# EAGLE design RK05TA (EAGLE 6.6.0)

## Sheet 1 of 2
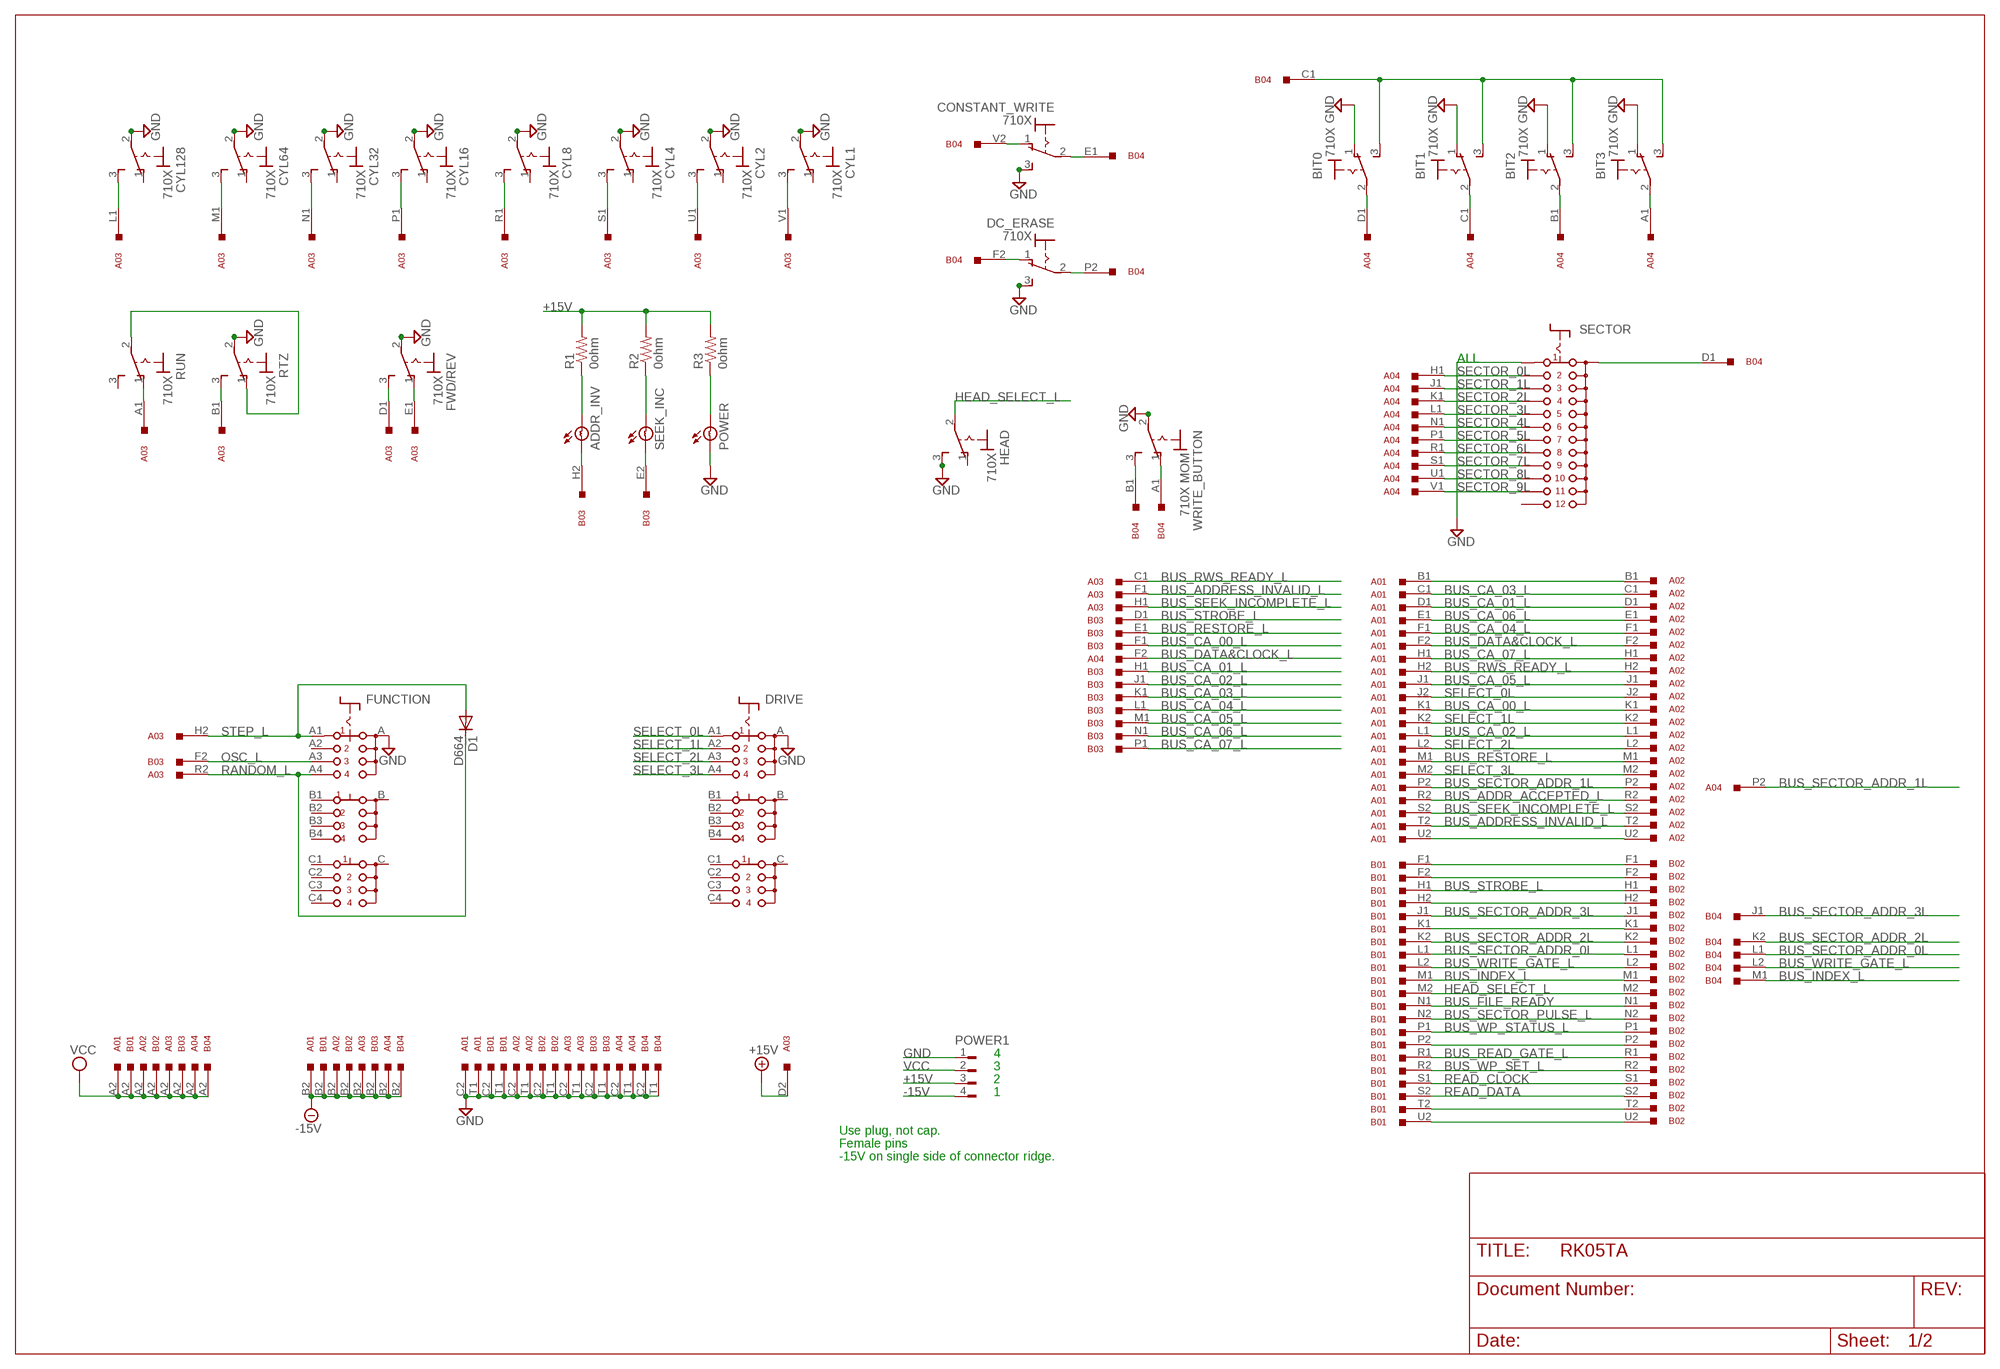
[diagram p0: schematic, sheet 1]

### Parts
A01  BC11A  M916  [H807]
A02  M930  M916  [H807]
A03  G503  M916  [H807]
A04  G502  M916  [H807]
ADDR_INV  BULB  [BULB]
B01  BC11A  M916  [H807]
B02  M930  M916  [H807]
B03  G503  M916  [H807]
B04  G502  M916  [H807]
BIT0  710X  [7109MD9V3]
BIT1  710X  [7109MD9V3]
BIT2  710X  [7109MD9V3]
BIT3  710X  [7109MD9V3]
CONSTANT_WRITE  710X  [7109MD9V3]
CYL1  710X  [7109MD9V3]
CYL2  710X  [7109MD9V3]
CYL4  710X  [7109MD9V3]
CYL8  710X  [7109MD9V3]
CYL16  710X  [7109MD9V3]
CYL32  710X  [7109MD9V3]
CYL64  710X  [7109MD9V3]
CYL128  710X  [7109MD9V3]
D1  D664  1N4148DO35-10  [DO35-10]
DC_ERASE  710X  [7109MD9V3]
DRIVE  CK103X04  [CK103X04]
FUNCTION  CK103X04  [CK103X04]
FWD/REV  710X  [7109MD9V3]
HEAD  710X  [7109MD9V3]
POWER  BULB  [BULB]
POWER1  FLOPPY-4  [FLOPPY-4]
R1  0ohm  R-US_0207/10  [0207/10]
R2  0ohm  R-US_0207/10  [0207/10]
R3  0ohm  R-US_0207/10  [0207/10]
RTZ  710X  [7109MD9V3]
RUN  710X  [7109MD9V3]
SECTOR  CK101X12  [CK101X12]
SEEK_INC  BULB  [BULB]
WRITE_BUTTON  710X MOM  710X  [7109MD9V3]

### Nets
+3VA: B04.F2 DC_ERASE.1(O) ; also sheet 2
+3VC: B04.V2 CONSTANT_WRITE.1(O) ; also sheet 2
+15V [Supply]: A03.D2 POWER1.3 R1.2 R2.2 R3.2 ; also sheet 2
-15V [Supply]: A01.B2 A02.B2 A03.B2 A04.B2 B01.B2 B02.B2 B03.B2 B04.B2 POWER1.4 ; also sheet 2
ADDRESS_INVALID_L: ADDR_INV.B B03.H2 ; also sheet 2
BIT_0L: A04.D1 BIT0.2(P) ; also sheet 2
BIT_1L: A04.C1 BIT1.2(P) ; also sheet 2
BIT_2L: A04.B1 BIT2.2(P) ; also sheet 2
BIT_3L: A04.A1 BIT3.2(P) ; also sheet 2
BUS_ADDR_ACCEPTED_L: A01.R2 A02.R2
BUS_ADDRESS_INVALID_L: A01.T2 A02.T2 A03.F1
BUS_CA_00_L: A01.K1 A02.K1 B03.F1
BUS_CA_01_L: A01.D1 A02.D1 B03.H1
BUS_CA_02_L: A01.L1 A02.L1 B03.J1
BUS_CA_03_L: A01.C1 A02.C1 B03.K1
BUS_CA_04_L: A01.F1 A02.F1 B03.L1
BUS_CA_05_L: A01.J1 A02.J1 B03.M1
BUS_CA_06_L: A01.E1 A02.E1 B03.N1
BUS_CA_07_L: A01.H1 A02.H1 B03.P1
BUS_DATA&CLOCK_L: A01.F2 A02.F2 A04.F2
BUS_FILE_READY: B01.N1 B02.N1
BUS_INDEX_L: B01.M1 B02.M1 B04.M1
BUS_READ_GATE_L: B01.R1 B02.R1
BUS_RESTORE_L: A01.M1 A02.M1 B03.E1
BUS_RWS_READY_L: A01.H2 A02.H2 A03.C1
BUS_SECTOR_ADDR_0L: B01.L1 B02.L1 B04.L1
BUS_SECTOR_ADDR_1L: A01.P2 A02.P2 A04.P2
BUS_SECTOR_ADDR_2L: B01.K2 B02.K2 B04.K2
BUS_SECTOR_ADDR_3L: B01.J1 B02.J1 B04.J1
BUS_SECTOR_PULSE_L: B01.N2 B02.N2
BUS_SEEK_INCOMPLETE_L: A01.S2 A02.S2 A03.H1
BUS_STROBE_L: B01.H1 B02.H1 B03.D1
BUS_WP_SET_L: B01.R2 B02.R2
BUS_WP_STATUS_L: B01.P1 B02.P1
BUS_WRITE_GATE_L: B01.L2 B02.L2 B04.L2
CA_SW_1: A03.V1 CYL1.3(S) ; also sheet 2
CA_SW_2: A03.U1 CYL2.3(S) ; also sheet 2
CA_SW_4: A03.S1 CYL4.3(S) ; also sheet 2
CA_SW_8: A03.R1 CYL8.3(S) ; also sheet 2
CA_SW_16: A03.P1 CYL16.3(S) ; also sheet 2
CA_SW_32: A03.N1 CYL32.3(S) ; also sheet 2
CA_SW_64: A03.M1 CYL64.3(S) ; also sheet 2
CA_SW_128: A03.L1 CYL128.3(S) ; also sheet 2
CONSTANT_WRITE_L: B04.E1 CONSTANT_WRITE.2(P) ; also sheet 2
DATA_BITS: B04.C1 BIT0.3(S) BIT1.3(S) BIT2.3(S) BIT3.3(S) ; also sheet 2
DC_ERASE: B04.P2 DC_ERASE.2(P) ; also sheet 2
FWD_L: A03.D1 FWD/REV.3(S) ; also sheet 2
GND [Supply]: A01.C2 A01.T1 A02.C2 A02.T1 A03.C2 A03.T1 A04.C2 A04.T1 B01.C2 B01.T1 B02.C2 B02.T1 B03.C2 B03.T1 B04.C2 B04.T1 BIT0.1(O) BIT1.1(O) BIT2.1(O) BIT3.1(O) CONSTANT_WRITE.3(S) CYL1.2(P) CYL2.2(P) CYL4.2(P) CYL8.2(P) CYL16.2(P) CYL32.2(P) CYL64.2(P) CYL128.2(P) DC_ERASE.3(S) DRIVE.A FUNCTION.A FWD/REV.2(P) HEAD.3(S) POWER1.1 POWER.B RTZ.2(P) SECTOR.1 WRITE_BUTTON.2(P) ; also sheet 2
HEAD_SELECT_L: B01.M2 B02.M2 HEAD.2(P) ; also sheet 2
N$30: RTZ.1(O) RUN.2(P)
N$37: ADDR_INV.A R1.1
N$38: R2.1 SEEK_INC.A
N$39: POWER.A R3.1
N$45: A01.U2 A02.U2
N$49: B01.T2 B02.T2
N$50: A01.B1 A02.B1
N$51: B01.F1 B02.F1
N$52: B01.F2 B02.F2
N$54: B01.H2 B02.H2
N$56: B01.K1 B02.K1
N$74: B01.P2 B02.P2
N$79: B01.U2 B02.U2
OSC_L: B03.F2 FUNCTION.A3 ; also sheet 2
RANDOM_L: A03.R2 D1.C FUNCTION.A4 ; also sheet 2
READ_CLOCK: B01.S1 B02.S1
READ_DATA: B01.S2 B02.S2
REV_L: A03.E1 FWD/REV.1(O) ; also sheet 2
RTZ_L: A03.B1 RTZ.3(S) ; also sheet 2
RUN_L: A03.A1 RUN.1(O) ; also sheet 2
SECTOR_0L: A04.H1 SECTOR.2 ; also sheet 2
SECTOR_1L: A04.J1 SECTOR.3 ; also sheet 2
SECTOR_2L: A04.K1 SECTOR.4 ; also sheet 2
SECTOR_3L: A04.L1 SECTOR.5 ; also sheet 2
SECTOR_4L: A04.N1 SECTOR.6 ; also sheet 2
SECTOR_5L: A04.P1 SECTOR.7 ; also sheet 2
SECTOR_6L: A04.R1 SECTOR.8 ; also sheet 2
SECTOR_7L: A04.S1 SECTOR.9 ; also sheet 2
SECTOR_8L: A04.U1 SECTOR.10 ; also sheet 2
SECTOR_9L: A04.V1 SECTOR.11 ; also sheet 2
SECTOR_SELECT_L: B04.D1 SECTOR.A ; also sheet 2
SEEK_INCOMPLETE_L: B03.E2 SEEK_INC.B ; also sheet 2
SELECT_0L: A01.J2 A02.J2 DRIVE.A1 ; also sheet 2
SELECT_1L: A01.K2 A02.K2 DRIVE.A2 ; also sheet 2
SELECT_2L: A01.L2 A02.L2 DRIVE.A3 ; also sheet 2
SELECT_3L: A01.M2 A02.M2 DRIVE.A4 ; also sheet 2
STEP_L: A03.H2 D1.A FUNCTION.A1 ; also sheet 2
VCC [Supply]: A01.A2 A02.A2 A03.A2 A04.A2 B01.A2 B02.A2 B03.A2 B04.A2 POWER1.2 ; also sheet 2
WRITE_H: B04.A1 WRITE_BUTTON.1(O) ; also sheet 2
WRITE_L: B04.B1 WRITE_BUTTON.3(S) ; also sheet 2
Unconnected: A01.A1 A01.D2 A01.E2 A01.N1 A01.N2 A01.P1 A01.R1 A01.S1 A01.U1 A01.V1 A01.V2 A02.A1 A02.D2 A02.E2 A02.N1 A02.N2 A02.P1 A02.R1 A02.S1 A02.U1 A02.V1 A02.V2 A03.E2 A03.F2 A03.J1 A03.J2 A03.K1 A03.K2 A03.L2 A03.M2 A03.N2 A03.P2 A03.S2 A03.T2 A03.U2 A03.V2 A04.D2 A04.E1 A04.E2 A04.F1 A04.H2 A04.J2 A04.K2 A04.L2 A04.M1 A04.M2 A04.N2 A04.R2 A04.S2 A04.T2 A04.U2 A04.V2 B01.A1 B01.B1 B01.C1 B01.D1 B01.D2 B01.E1 B01.E2 B01.J2 B01.U1 B01.V1 B01.V2 B02.A1 B02.B1 B02.C1 B02.D1 B02.D2 B02.E1 B02.E2 B02.J2 B02.U1 B02.V1 B02.V2 B03.A1 B03.B1 B03.C1 B03.D2 B03.J2 B03.K2 B03.L2 B03.M2 B03.N2 B03.P2 B03.R1 B03.R2 B03.S1 B03.S2 B03.T2 B03.U1 B03.U2 B03.V1 B03.V2 B04.D2 B04.E2 B04.F1 B04.H1 B04.H2 B04.J2 B04.K1 B04.M2 B04.N1 B04.N2 B04.P1 B04.R1 B04.R2 B04.S1 B04.S2 B04.T2 B04.U1 B04.U2 B04.V1 CYL1.1(O) CYL2.1(O) CYL4.1(O) CYL8.1(O) CYL16.1(O) CYL32.1(O) CYL64.1(O) CYL128.1(O) DRIVE.B DRIVE.B1 DRIVE.B2 DRIVE.B3 DRIVE.B4 DRIVE.C DRIVE.C1 DRIVE.C2 DRIVE.C3 DRIVE.C4 FUNCTION.A2 FUNCTION.B FUNCTION.B1 FUNCTION.B2 FUNCTION.B3 FUNCTION.B4 FUNCTION.C FUNCTION.C1 FUNCTION.C2 FUNCTION.C3 FUNCTION.C4 HEAD.1(O) RUN.3(S) SECTOR.12

### Notes on the sheet
- ALL
- 4
- 3
- 2
- 1
- Use plug, not cap.
- Female pins
- -15V on single side of connector ridge.

## Sheet 2 of 2
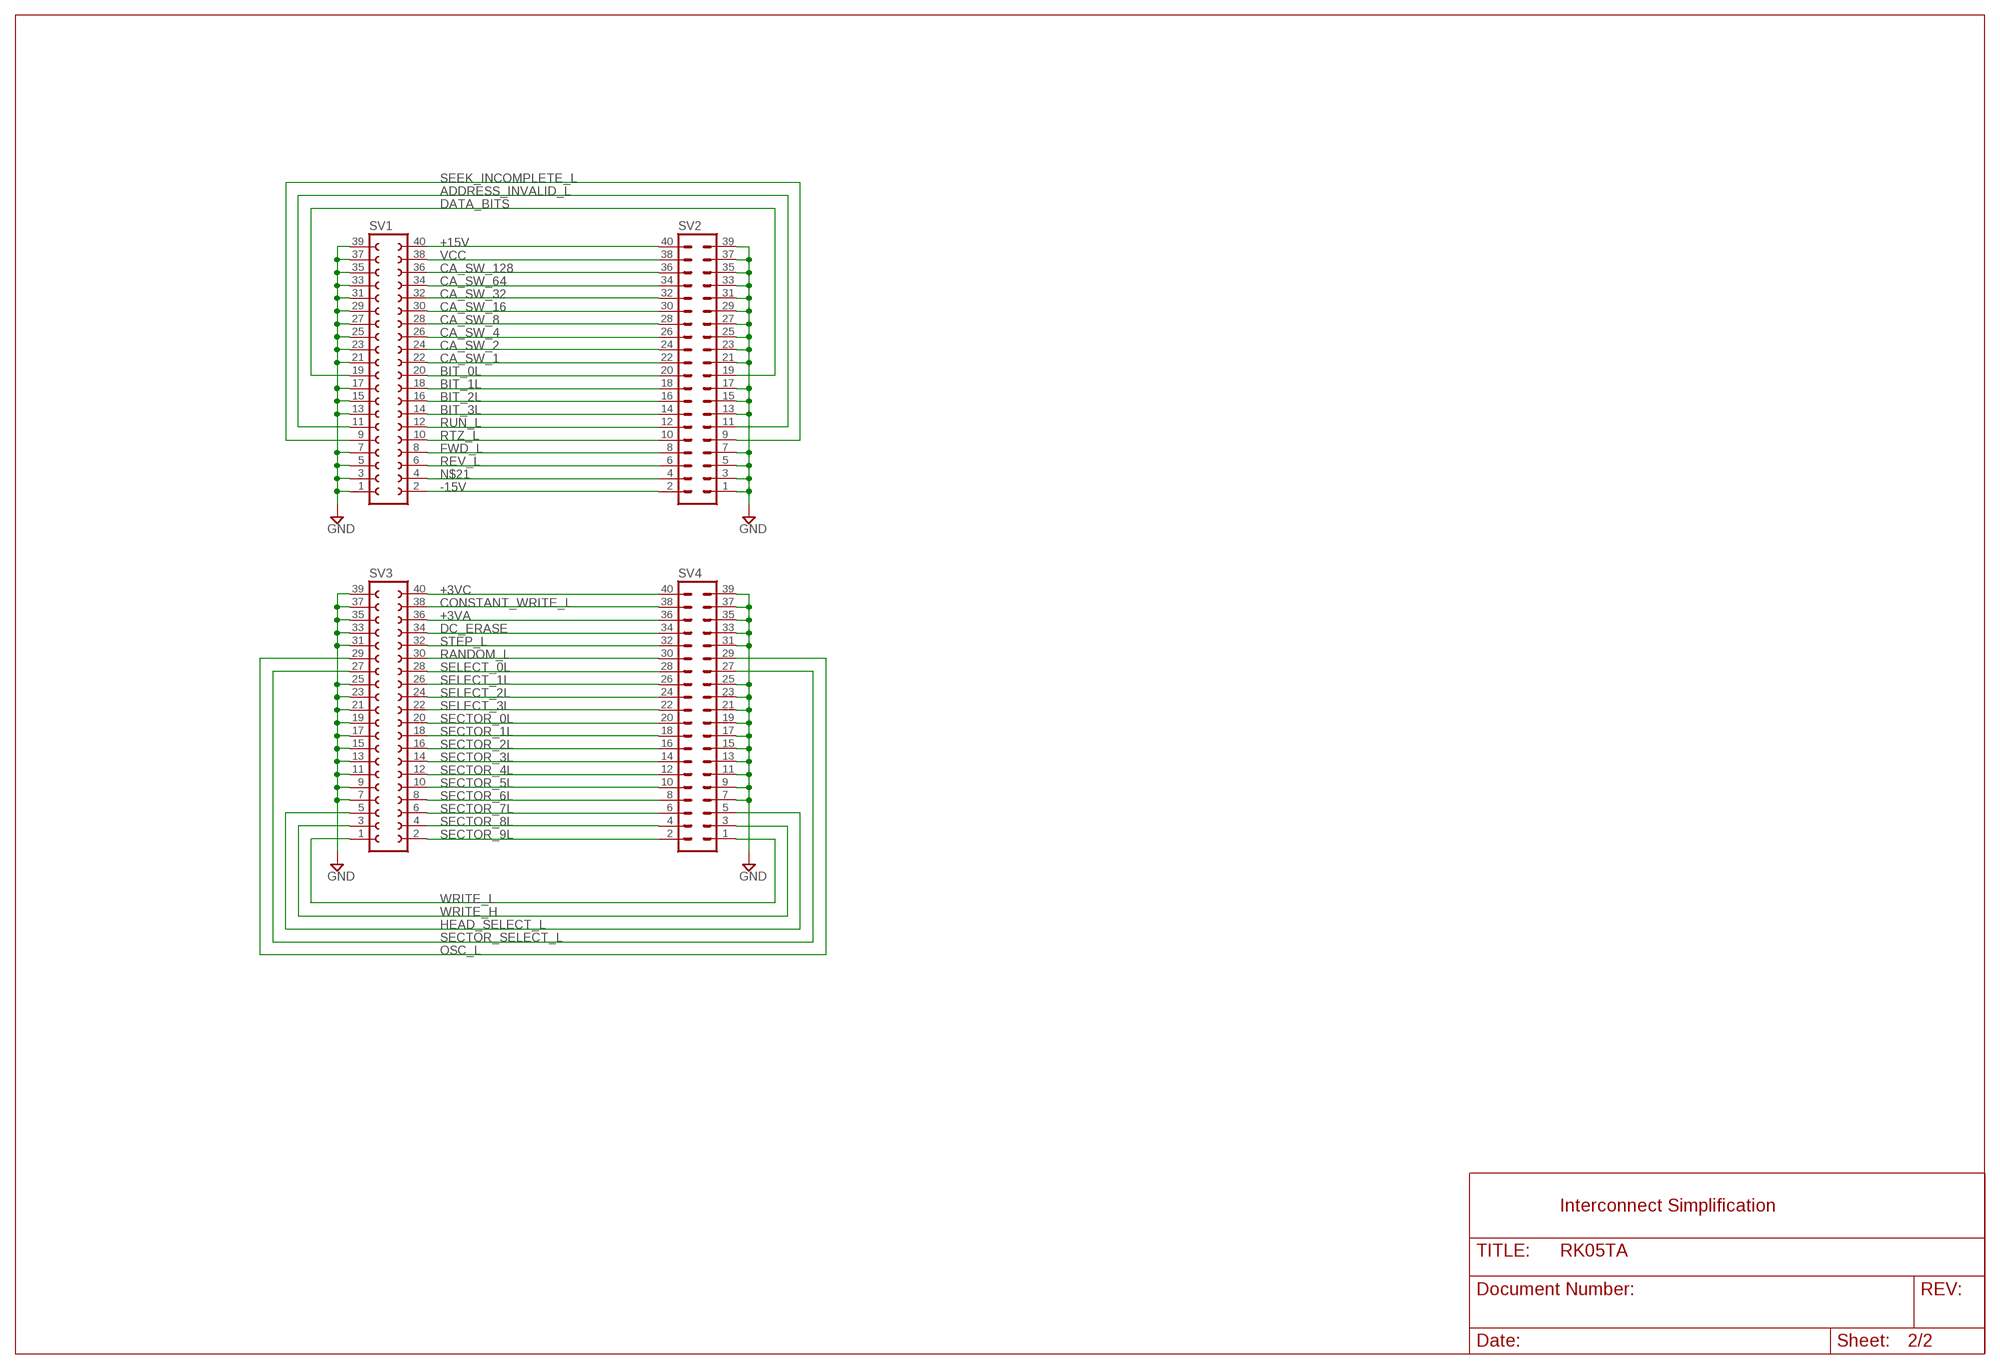
[diagram p1: schematic, sheet 2]

### Parts
SV1  FE20-2W  [FE20-2W]
SV2  MA20-2  [MA20-2]
SV3  FE20-2W  [FE20-2W]
SV4  MA20-2  [MA20-2]

### Nets
+3VA: SV3.36 SV4.36 ; also sheet 1
+3VC: SV3.40 SV4.40 ; also sheet 1
+15V [Supply]: SV1.40 SV2.40 ; also sheet 1
-15V [Supply]: SV1.2 SV2.2 ; also sheet 1
ADDRESS_INVALID_L: SV1.11 SV2.11 ; also sheet 1
BIT_0L: SV1.20 SV2.20 ; also sheet 1
BIT_1L: SV1.18 SV2.18 ; also sheet 1
BIT_2L: SV1.16 SV2.16 ; also sheet 1
BIT_3L: SV1.14 SV2.14 ; also sheet 1
CA_SW_1: SV1.22 SV2.22 ; also sheet 1
CA_SW_2: SV1.24 SV2.24 ; also sheet 1
CA_SW_4: SV1.26 SV2.26 ; also sheet 1
CA_SW_8: SV1.28 SV2.28 ; also sheet 1
CA_SW_16: SV1.30 SV2.30 ; also sheet 1
CA_SW_32: SV1.32 SV2.32 ; also sheet 1
CA_SW_64: SV1.34 SV2.34 ; also sheet 1
CA_SW_128: SV1.36 SV2.36 ; also sheet 1
CONSTANT_WRITE_L: SV3.38 SV4.38 ; also sheet 1
DATA_BITS: SV1.19 SV2.19 ; also sheet 1
DC_ERASE: SV3.34 SV4.34 ; also sheet 1
FWD_L: SV1.8 SV2.8 ; also sheet 1
GND [Supply]: SV1.1 SV1.3 SV1.5 SV1.7 SV1.13 SV1.15 SV1.17 SV1.21 SV1.23 SV1.25 SV1.27 SV1.29 SV1.31 SV1.33 SV1.35 SV1.37 SV1.39 SV2.1 SV2.3 SV2.5 SV2.7 SV2.13 SV2.15 SV2.17 SV2.21 SV2.23 SV2.25 SV2.27 SV2.29 SV2.31 SV2.33 SV2.35 SV2.37 SV2.39 SV3.7 SV3.9 SV3.11 SV3.13 SV3.15 SV3.17 SV3.19 SV3.21 SV3.23 SV3.25 SV3.31 SV3.33 SV3.35 SV3.37 SV3.39 SV4.7 SV4.9 SV4.11 SV4.13 SV4.15 SV4.17 SV4.19 SV4.21 SV4.23 SV4.25 SV4.31 SV4.33 SV4.35 SV4.37 SV4.39 ; also sheet 1
HEAD_SELECT_L: SV3.5 SV4.5 ; also sheet 1
N$21: SV1.4 SV2.4
OSC_L: SV3.29 SV4.29 ; also sheet 1
RANDOM_L: SV3.30 SV4.30 ; also sheet 1
REV_L: SV1.6 SV2.6 ; also sheet 1
RTZ_L: SV1.10 SV2.10 ; also sheet 1
RUN_L: SV1.12 SV2.12 ; also sheet 1
SECTOR_0L: SV3.20 SV4.20 ; also sheet 1
SECTOR_1L: SV3.18 SV4.18 ; also sheet 1
SECTOR_2L: SV3.16 SV4.16 ; also sheet 1
SECTOR_3L: SV3.14 SV4.14 ; also sheet 1
SECTOR_4L: SV3.12 SV4.12 ; also sheet 1
SECTOR_5L: SV3.10 SV4.10 ; also sheet 1
SECTOR_6L: SV3.8 SV4.8 ; also sheet 1
SECTOR_7L: SV3.6 SV4.6 ; also sheet 1
SECTOR_8L: SV3.4 SV4.4 ; also sheet 1
SECTOR_9L: SV3.2 SV4.2 ; also sheet 1
SECTOR_SELECT_L: SV3.27 SV4.27 ; also sheet 1
SEEK_INCOMPLETE_L: SV1.9 SV2.9 ; also sheet 1
SELECT_0L: SV3.28 SV4.28 ; also sheet 1
SELECT_1L: SV3.26 SV4.26 ; also sheet 1
SELECT_2L: SV3.24 SV4.24 ; also sheet 1
SELECT_3L: SV3.22 SV4.22 ; also sheet 1
STEP_L: SV3.32 SV4.32 ; also sheet 1
VCC [Supply]: SV1.38 SV2.38 ; also sheet 1
WRITE_H: SV3.3 SV4.3 ; also sheet 1
WRITE_L: SV3.1 SV4.1 ; also sheet 1

### Notes on the sheet
- Interconnect Simplification

## Power pins joined to a net without a drawn wire
GND: BIT0.NC@1(GND) BIT0.NC@2(GND) BIT0.NC@3(GND) BIT0.NC@4(GND) BIT0.NC@5(GND) BIT0.NC@6(GND) BIT0.NC@7(GND) BIT0.NC@8(GND) BIT1.NC@1(GND) BIT1.NC@2(GND) BIT1.NC@3(GND) BIT1.NC@4(GND) BIT1.NC@5(GND) BIT1.NC@6(GND) BIT1.NC@7(GND) BIT1.NC@8(GND) BIT2.NC@1(GND) BIT2.NC@2(GND) BIT2.NC@3(GND) BIT2.NC@4(GND) BIT2.NC@5(GND) BIT2.NC@6(GND) BIT2.NC@7(GND) BIT2.NC@8(GND) BIT3.NC@1(GND) BIT3.NC@2(GND) BIT3.NC@3(GND) BIT3.NC@4(GND) BIT3.NC@5(GND) BIT3.NC@6(GND) BIT3.NC@7(GND) BIT3.NC@8(GND) CONSTANT_WRITE.NC@1(GND) CONSTANT_WRITE.NC@2(GND) CONSTANT_WRITE.NC@3(GND) CONSTANT_WRITE.NC@4(GND) CONSTANT_WRITE.NC@5(GND) CONSTANT_WRITE.NC@6(GND) CONSTANT_WRITE.NC@7(GND) CONSTANT_WRITE.NC@8(GND) CYL1.NC@1(GND) CYL1.NC@2(GND) CYL1.NC@3(GND) CYL1.NC@4(GND) CYL1.NC@5(GND) CYL1.NC@6(GND) CYL1.NC@7(GND) CYL1.NC@8(GND) CYL2.NC@1(GND) CYL2.NC@2(GND) CYL2.NC@3(GND) CYL2.NC@4(GND) CYL2.NC@5(GND) CYL2.NC@6(GND) CYL2.NC@7(GND) CYL2.NC@8(GND) CYL4.NC@1(GND) CYL4.NC@2(GND) CYL4.NC@3(GND) CYL4.NC@4(GND) CYL4.NC@5(GND) CYL4.NC@6(GND) CYL4.NC@7(GND) CYL4.NC@8(GND) CYL8.NC@1(GND) CYL8.NC@2(GND) CYL8.NC@3(GND) CYL8.NC@4(GND) CYL8.NC@5(GND) CYL8.NC@6(GND) CYL8.NC@7(GND) CYL8.NC@8(GND) CYL16.NC@1(GND) CYL16.NC@2(GND) CYL16.NC@3(GND) CYL16.NC@4(GND) CYL16.NC@5(GND) CYL16.NC@6(GND) CYL16.NC@7(GND) CYL16.NC@8(GND) CYL32.NC@1(GND) CYL32.NC@2(GND) CYL32.NC@3(GND) CYL32.NC@4(GND) CYL32.NC@5(GND) CYL32.NC@6(GND) CYL32.NC@7(GND) CYL32.NC@8(GND) CYL64.NC@1(GND) CYL64.NC@2(GND) CYL64.NC@3(GND) CYL64.NC@4(GND) CYL64.NC@5(GND) CYL64.NC@6(GND) CYL64.NC@7(GND) CYL64.NC@8(GND) CYL128.NC@1(GND) CYL128.NC@2(GND) CYL128.NC@3(GND) CYL128.NC@4(GND) CYL128.NC@5(GND) CYL128.NC@6(GND) CYL128.NC@7(GND) CYL128.NC@8(GND) DC_ERASE.NC@1(GND) DC_ERASE.NC@2(GND) DC_ERASE.NC@3(GND) DC_ERASE.NC@4(GND) DC_ERASE.NC@5(GND) DC_ERASE.NC@6(GND) DC_ERASE.NC@7(GND) DC_ERASE.NC@8(GND) FWD/REV.NC@1(GND) FWD/REV.NC@2(GND) FWD/REV.NC@3(GND) FWD/REV.NC@4(GND) FWD/REV.NC@5(GND) FWD/REV.NC@6(GND) FWD/REV.NC@7(GND) FWD/REV.NC@8(GND) HEAD.NC@1(GND) HEAD.NC@2(GND) HEAD.NC@3(GND) HEAD.NC@4(GND) HEAD.NC@5(GND) HEAD.NC@6(GND) HEAD.NC@7(GND) HEAD.NC@8(GND) RTZ.NC@1(GND) RTZ.NC@2(GND) RTZ.NC@3(GND) RTZ.NC@4(GND) RTZ.NC@5(GND) RTZ.NC@6(GND) RTZ.NC@7(GND) RTZ.NC@8(GND) RUN.NC@1(GND) RUN.NC@2(GND) RUN.NC@3(GND) RUN.NC@4(GND) RUN.NC@5(GND) RUN.NC@6(GND) RUN.NC@7(GND) RUN.NC@8(GND) WRITE_BUTTON.NC@1(GND) WRITE_BUTTON.NC@2(GND) WRITE_BUTTON.NC@3(GND) WRITE_BUTTON.NC@4(GND) WRITE_BUTTON.NC@5(GND) WRITE_BUTTON.NC@6(GND) WRITE_BUTTON.NC@7(GND) WRITE_BUTTON.NC@8(GND)

## Library data of the parts
A01-A04 B01-B04 = dec-m:M916: Simple 36 pin connector/wire cable
ADDR_INV POWER SEEK_INC = dec-con:BULB: T 1 3/4 Bulb
BIT0 BIT1-BIT3 CONSTANT_WRITE CYL1 CYL2 CYL4 CYL8 CYL16 CYL32 CYL64 CYL128 DC_ERASE FWD/REV HEAD RTZ RUN WRITE_BUTTON = dec-con:710X: 710x with optional V2 or V3 mounting bracket.
D1 = diode:1N4148: DIODE high speed (Philips)
DRIVE FUNCTION = switch:CK103X04: ROTARY SWITCH C&K
POWER1 = con-amp:FLOPPY-4: MATE N-LOCK Floppy / HDD conector Distributor: Bürklin 71F970
R1-R3 = rcl:R-US_: RESISTOR, American symbol
SECTOR = switch:CK101X12: ROTARY SWITCH C&K
SV1 SV3 = con-lsta:FE20-2W: FEMALE HEADER; OC_FARNELL: unknown; OC_NEWARK: unknown
SV2 SV4 = con-lstb:MA20-2: PIN HEADER; OC_FARNELL: unknown; OC_NEWARK: unknown

## Net classes
0 default: width 0.508 mm
1 Supply: width 0.813 mm

## Board
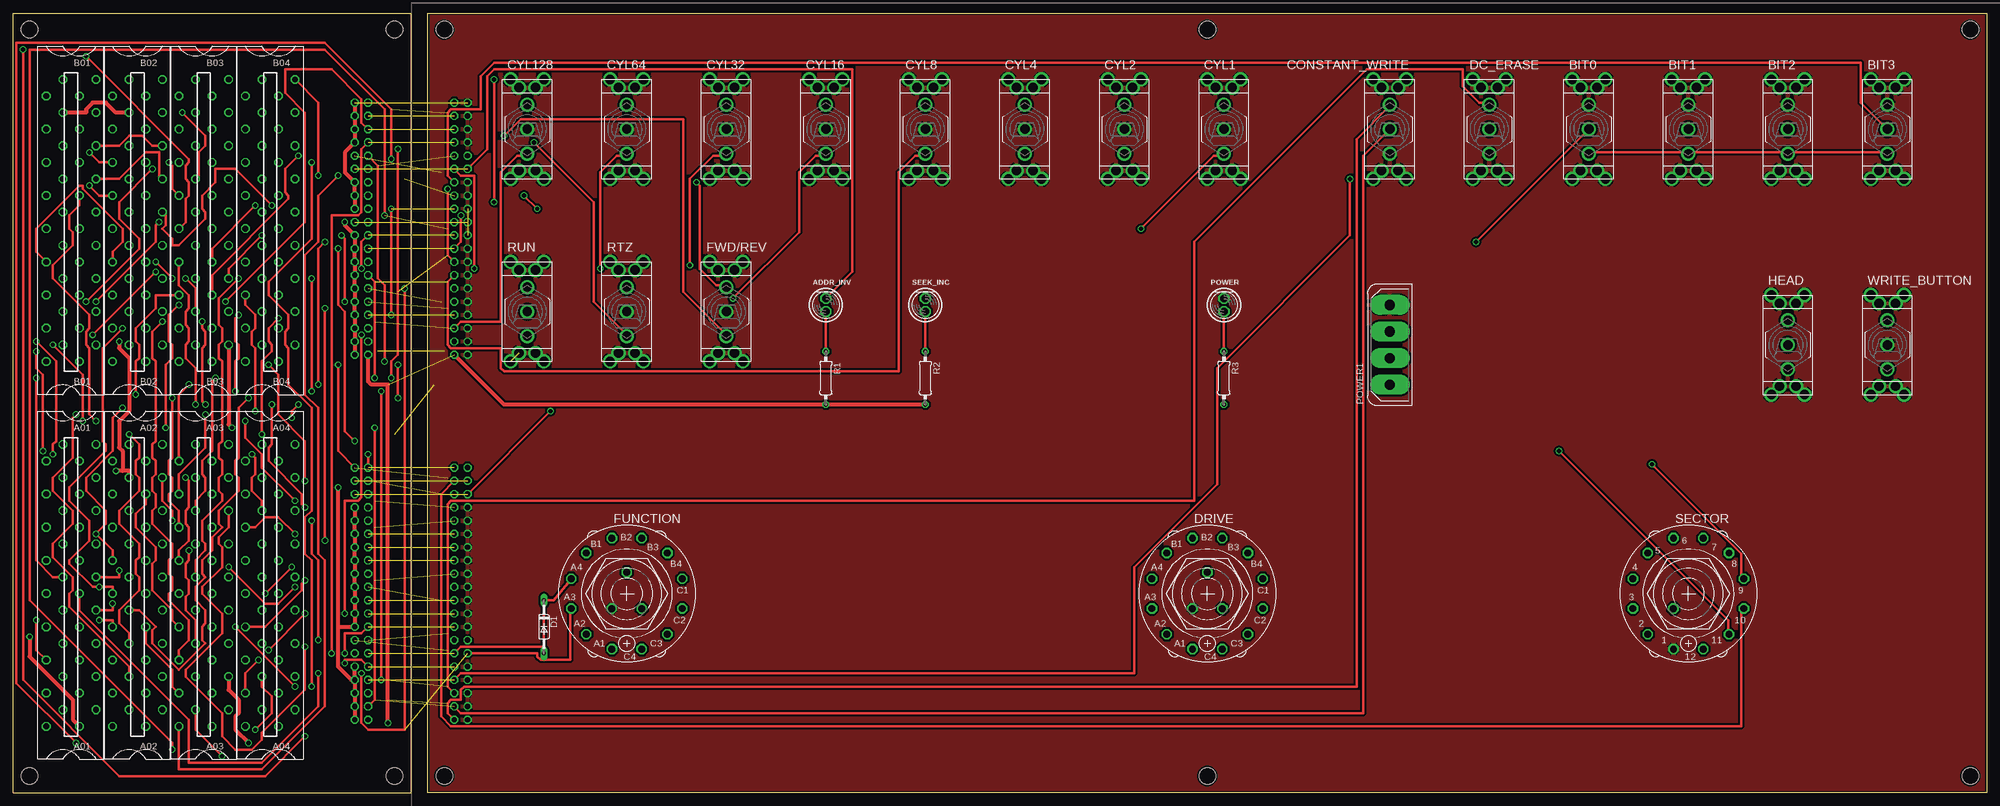
[diagram p2: board, top side]
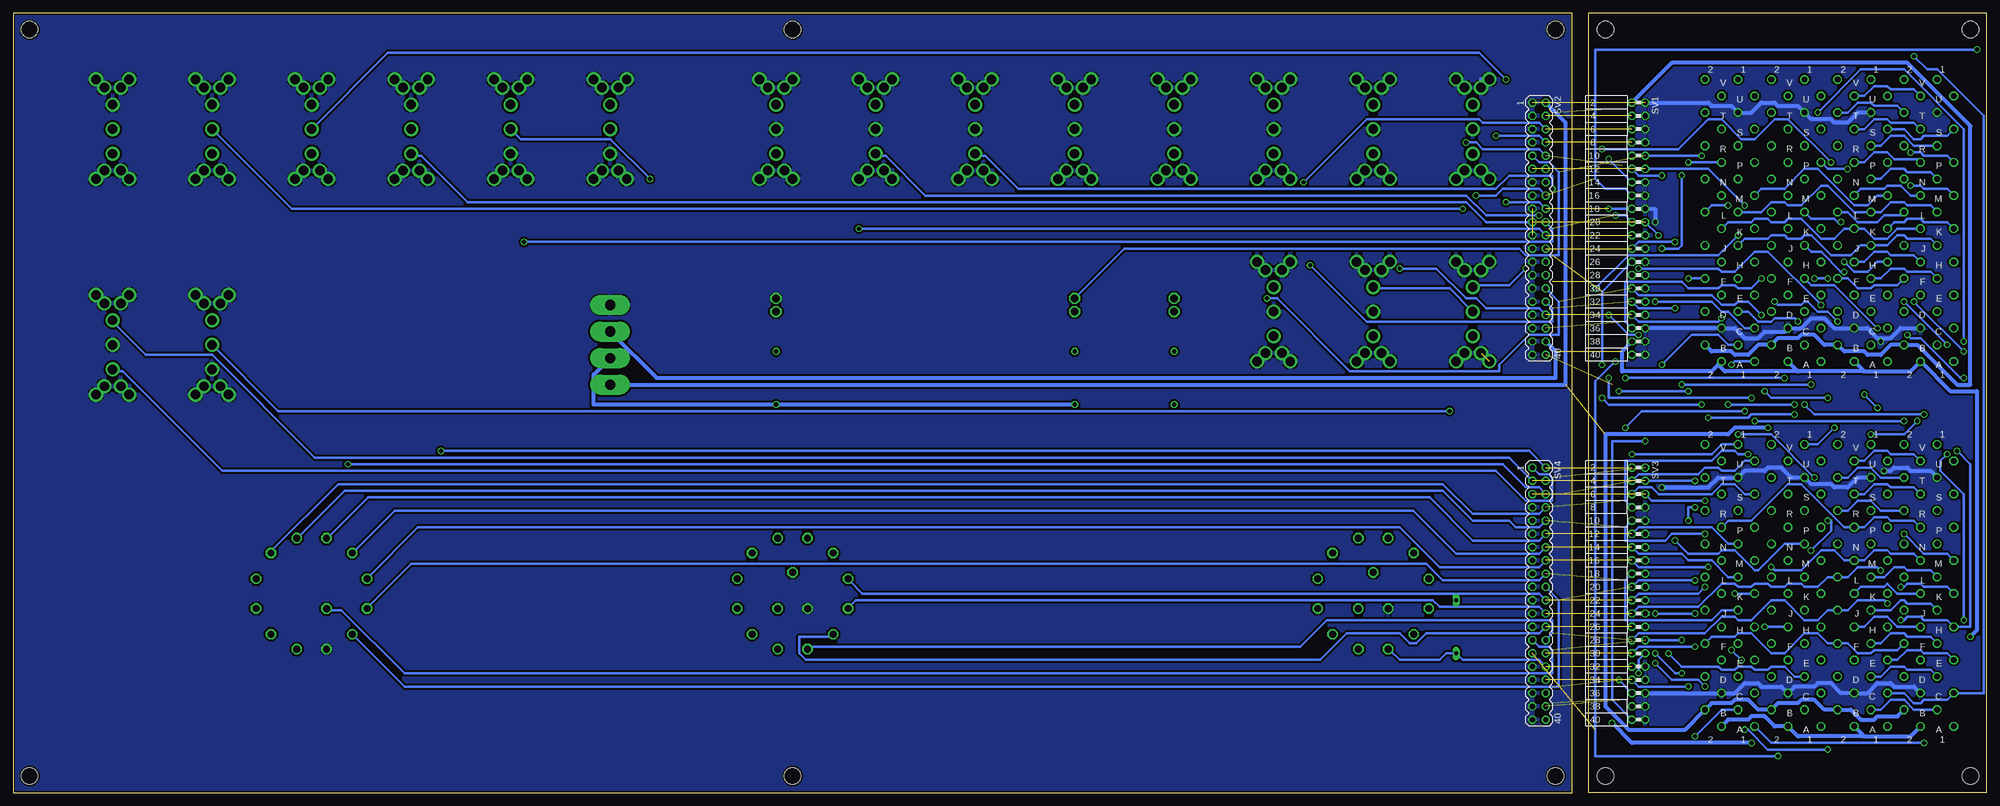
[diagram p3: board, bottom side, seen from below]

Size 377.82 x 149.22 mm. Coordinates in mm from the lower left corner, seen from the top.
Outline: 79.38,0 79.38,149.22 377.82,149.22 377.82,0 79.38,0
Outline: 0,0 0,149.22 76.2,149.22 76.2,0 0,0
Copper layers (1+16): Top 0.035mm / dielectric 1.5mm / Bottom 0.035mm
Design rules "16mils": minimum track width 16mil, minimum drill 32mil, track to track 15mil, track to pad 10mil, pad to pad 10mil, via to via 10mil, smd to smd 10mil, copper to edge 13mil, drill to drill 10mil, minimum pad ring 10mil, minimum via ring 8mil, stop-mask expansion 0mil, vias tented up to drill 0mil, thermal gap 10mil
Holes 3.2 mm at 3.17,146.05 73.03,146.05 3.17,3.17 73.03,3.17 82.55,3.17 82.55,146.05 374.65,146.05 374.65,3.17 228.6,3.17 228.6,146.05

### Footprints (pad centres in the part's own frame; a part is rotated, then mirrored left to right if it is on the bottom)
H807 = drill 1.092 octagon: A1 4.763,28.575; A2 -1.587,28.575; B1 1.587,25.4; B2 -4.763,25.4; C1 4.763,22.225; C2 -1.587,22.225; D1 1.587,19.05; D2 -4.763,19.05; E1 4.763,15.875; E2 -1.587,15.875; F1 1.587,12.7; F2 -4.763,12.7; H1 4.763,9.525; H2 -1.587,9.525; J1 1.587,6.35; J2 -4.763,6.35; K1 4.763,3.175; K2 -1.587,3.175; L1 1.587,0; L2 -4.763,0; M1 4.763,-3.175; M2 -1.587,-3.175; N1 1.587,-6.35; N2 -4.763,-6.35; P1 4.763,-9.525; P2 -1.587,-9.525; R1 1.587,-12.7; R2 -4.763,-12.7; S1 4.763,-15.875; S2 -1.587,-15.875; T1 1.587,-19.05; T2 -4.763,-19.05; U1 4.763,-22.225; U2 -1.587,-22.225; V1 1.587,-25.4; V2 -4.763,-25.4
BULB = drill 1.422 octagon: A 0,0; B 0,2.54
7109MD9V3 = drill 1.803: 1 0,4.699; 2 0,0; 3 0,-4.699; NC@1 -3.175,9.525; NC@2 -1.587,7.938; NC@3 3.175,9.525; NC@4 1.587,7.938; NC@5 -3.175,-9.525; NC@6 -1.587,-7.938; NC@7 1.587,-7.938; NC@8 3.175,-9.525
DO35-10 = drill 0.813 long: A 5.08,0; C -5.08,0
CK103X04 = drill 1.321 octagon: A -2.87,-2.87; A1 -2.845,-10.617; A2 -7.772,-7.772; A3 -10.617,-2.845; A4 -10.617,2.845; B 0,4.059; B1 -7.772,7.772; B2 -2.845,10.617; B3 2.845,10.617; B4 7.772,7.772; C 2.87,-2.87; C1 10.617,2.845; C2 10.617,-2.845; C3 7.772,-7.772; C4 2.845,-10.617
FLOPPY-4 = drill 1.93 pad 3.81 long: 1 7.62,0; 2 2.54,0; 3 -2.54,0; 4 -7.62,0
0207/10 = drill 0.813 octagon: 1 -5.08,0; 2 5.08,0
CK101X12 = drill 1.321 octagon: 1 -2.845,-10.617; 2 -7.772,-7.772; 3 -10.617,-2.845; 4 -10.617,2.845; 5 -7.772,7.772; 6 -2.845,10.617; 7 2.845,10.617; 8 7.772,7.772; 9 10.617,2.845; 10 10.617,-2.845; 11 7.772,-7.772; 12 2.845,-10.617; A -2.87,-2.87
FE20-2W = drill 1.016 octagon: 1 -24.13,1.27; 2 -24.13,-1.27; 3 -21.59,1.27; 4 -21.59,-1.27; 5 -19.05,1.27; 6 -19.05,-1.27; 7 -16.51,1.27; 8 -16.51,-1.27; 9 -13.97,1.27; 10 -13.97,-1.27; 11 -11.43,1.27; 12 -11.43,-1.27; 13 -8.89,1.27; 14 -8.89,-1.27; 15 -6.35,1.27; 16 -6.35,-1.27; 17 -3.81,1.27; 18 -3.81,-1.27; 19 -1.27,1.27; 20 -1.27,-1.27; 21 1.27,1.27; 22 1.27,-1.27; 23 3.81,1.27; 24 3.81,-1.27; 25 6.35,1.27; 26 6.35,-1.27; 27 8.89,1.27; 28 8.89,-1.27; 29 11.43,1.27; 30 11.43,-1.27; 31 13.97,1.27; 32 13.97,-1.27; 33 16.51,1.27; 34 16.51,-1.27; 35 19.05,1.27; 36 19.05,-1.27; 37 21.59,1.27; 38 21.59,-1.27; 39 24.13,1.27; 40 24.13,-1.27
MA20-2 = drill 1.016 octagon: 1 -24.13,-1.27; 2 -24.13,1.27; 3 -21.59,-1.27; 4 -21.59,1.27; 5 -19.05,-1.27; 6 -19.05,1.27; 7 -16.51,-1.27; 8 -16.51,1.27; 9 -13.97,-1.27; 10 -13.97,1.27; 11 -11.43,-1.27; 12 -11.43,1.27; 13 -8.89,-1.27; 14 -8.89,1.27; 15 -6.35,-1.27; 16 -6.35,1.27; 17 -3.81,-1.27; 18 -3.81,1.27; 19 -1.27,-1.27; 20 -1.27,1.27; 21 1.27,-1.27; 22 1.27,1.27; 23 3.81,-1.27; 24 3.81,1.27; 25 6.35,-1.27; 26 6.35,1.27; 27 8.89,-1.27; 28 8.89,1.27; 29 11.43,-1.27; 30 11.43,1.27; 31 13.97,-1.27; 32 13.97,1.27; 33 16.51,-1.27; 34 16.51,1.27; 35 19.05,-1.27; 36 19.05,1.27; 37 21.59,-1.27; 38 21.59,1.27; 39 24.13,-1.27; 40 24.13,1.27

### Placement (x,y rotation side)
A01  11.11,41.28 180 top
A02  23.81,41.28 180 top
A03  36.51,41.28 180 top
A04  49.21,41.28 180 top
ADDR_INV  155.57,92.08 0 top
B01  11.11,111.12 180 top
B02  23.81,111.12 180 top
B03  36.51,111.12 180 top
B04  49.21,111.12 180 top
BIT0  301.62,127 0 top
BIT1  320.68,127 0 top
BIT2  339.72,127 0 top
BIT3  358.77,127 0 top
CONSTANT_WRITE  263.52,127 0 top
CYL1  231.77,127 0 top
CYL2  212.73,127 0 top
CYL4  193.68,127 0 top
CYL8  174.62,127 0 top
CYL16  155.57,127 0 top
CYL32  136.53,127 0 top
CYL64  117.47,127 0 top
CYL128  98.43,127 0 top
D1  101.6,31.75 270 top
DC_ERASE  282.57,127 0 top
DRIVE  228.6,38.1 0 top
FUNCTION  117.47,38.1 0 top
FWD/REV  136.53,92.08 0 top
HEAD  339.72,85.73 0 top
POWER  231.77,92.08 0 top
POWER1  263.52,85.73 90 top
R1  155.57,79.38 270 top
R2  174.62,79.38 270 top
R3  231.77,79.38 270 top
RTZ  117.47,92.08 0 top
RUN  98.43,92.08 0 top
SECTOR  320.68,38.1 0 top
SEEK_INC  174.62,92.08 0 top
SV1  66.67,107.95 270 bottom
SV2  85.73,107.95 270 bottom
SV3  66.67,38.1 270 bottom
SV4  85.73,38.1 270 bottom
WRITE_BUTTON  358.77,85.73 0 top

### Tracks (layer width: path | path; a pad name or v marks a point on that pad's centre or on a via)
+3VA  (via drill 0.81)  (1 unrouted)
  Top 0.508: v70.48,76.84 v70.48,21.59 | v57.15,98.42 v57.15,76.84 | SV4.36 83.19,20.32 83.19,55.25 83.82,55.88 226.06,55.88 226.06,105.41 259.08,138.43 277.5,138.43 277.5,135.25 280.67,132.08 282.57,132.08 DC_ERASE.1
  Bottom 0.508: v70.48,21.59 SV3.36 | v57.15,76.84 v70.48,76.84 | B04.F2 v57.15,98.42
+3VC  (via drill 0.81)  (1 unrouted)
  Top 0.508: v65.41,67.31 63.5,69.22 63.5,92.08 62.23,93.34 v62.23,104.14 | v58.42,118.11 58.42,132.08 B04.V2 | SV4.40 83.19,15.24 83.19,17.14 83.82,17.78 85.73,17.78 85.73,19.68 86.36,20.32 257.18,20.32 257.18,125.1 263.52,131.44 CONSTANT_WRITE.1
  Bottom 0.508: SV3.40 71.75,17.78 71.75,67.31 v65.41,67.31 | v62.23,104.14 59.06,104.14 58.42,104.78 v58.42,118.11
+15V  (via drill 0.81)  (1 unrouted)
  Top 0.813: SV1.40 67.95,78.74 68.58,78.11 71.75,78.11 v71.75,13.34 | v45.09,9.52 42.55,12.07 42.55,14.61 43.18,15.24 43.18,17.78 41.28,19.68 A03.D2 | R2.2 R1.2 93.98,74.3 SV2.40
  Bottom 0.813: v71.75,13.34 67.95,9.52 v45.09,9.52 | R2.2 R3.2 266.7,74.3 266.7,80.01 POWER1.3
-15V  (via drill 0.81)  (1 unrouted)
  Top 0.813: v41.91,69.85 41.28,70.48 B03.B2
  Bottom 0.813: A01.B2 17.15,14.61 20.96,14.61 21.59,13.97 24.13,13.97 26.04,15.88 A02.B2 31.12,15.88 33.02,17.78 35.56,17.78 36.2,17.14 40.01,17.14 A03.B2 43.82,15.88 45.72,17.78 48.26,17.78 48.9,17.14 52.7,17.14 A04.B2 57.79,12.07 68.58,12.07 73.03,16.51 73.03,68.58 49.53,68.58 48.26,69.85 v41.91,69.85 | SV1.2 60.33,139.7 15.24,139.7 3.17,127.64 3.17,78.11 5.72,78.11 13.34,85.73 B01.B2 18.42,85.73 20.32,83.82 22.86,83.82 23.5,84.45 27.3,84.45 B02.B2 31.12,85.73 33.02,87.63 35.56,87.63 36.2,87 40.01,87 B03.B2 43.82,85.73 45.72,83.82 48.26,83.82 48.9,84.45 52.7,84.45 B04.B2 | SV2.2 80.65,128.27 80.65,78.11 POWER1.4
ADDRESS_INVALID_L  (via drill 0.81)  (1 unrouted)
  Top 0.508: v46.36,112.39 38.1,104.14 B03.H2 | SV2.11 90.81,123.19 90.81,137.16 92.08,138.43 160.66,138.43 160.66,99.7 ADDR_INV.B
  Bottom 0.508: SV1.11 53.34,119.38 v46.36,112.39
BIT_0L  (via drill 0.81)  (1 unrouted)
  Top 0.508: v71.12,110.49 71.12,130.81 59.69,142.24 3.17,142.24 3.17,36.83 30.48,9.52 v30.48,8.25 | v46.36,12.07 49.53,15.24 49.53,18.41 47.62,20.32 A04.D1 | BIT0.2 v280.04,105.41
  Bottom 0.508: SV1.20 69.22,110.49 v71.12,110.49 | v30.48,8.25 41.91,8.25 45.72,12.07 v46.36,12.07 | SV2.20 83.19,107.95 83.19,105.41 v280.04,105.41
BIT_1L  (via drill 0.81)  (1 unrouted)
  Top 0.508: v72.39,91.44 v72.39,111.76 | v66.67,87.63 66.67,56.52 66.04,55.88 63.5,55.88 v63.5,34.29 | v48.9,27.3 v55.88,34.29 | v46.99,25.4 44.45,22.86 A04.C1 | v92.08,136.52 v92.08,113.03
  Bottom 0.508: v72.39,111.76 SV1.18 | v72.39,91.44 68.58,87.63 v66.67,87.63 | v55.88,34.29 v63.5,34.29 | v46.99,25.4 v48.9,27.3 | SV2.18 85.73,113.03 v92.08,113.03 | v92.08,136.52 97.16,141.6 306.07,141.6 BIT1.2
BIT_2L  (via drill 0.81)  (1 unrouted)
  Top 0.508: v1.91,142.24 1.91,21.59 20.32,3.17 48.26,3.17 v55.88,10.8 | v100.33,111.76 v97.79,114.3
  Bottom 0.508: SV1.16 69.22,115.57 73.03,115.57 74.93,117.48 74.93,142.24 v1.91,142.24 | v55.88,10.8 50.8,15.88 A04.B1 | SV2.16 85.73,115.57 92.71,115.57 93.98,114.3 v97.79,114.3 | v100.33,111.76 324.49,111.76 BIT2.2
BIT_3L  (via drill 0.81)  (1 unrouted)
  Top 0.508: v72.39,121.28 72.39,130.81 59.69,143.51 0.64,143.51 0.64,20.95 v12.06,9.52 | SV2.14 83.19,118.11 83.19,130.17 83.82,130.81 89.53,130.81 89.53,137.16 92.08,139.7 353.69,139.7 353.69,132.08 BIT3.2
  Bottom 0.508: v72.39,121.28 SV1.14 | v12.06,9.52 41.28,9.52 A04.A1
BUS_ADDR_ACCEPTED_L
  Bottom 0.508: A01.R2 20.32,53.98 22.23,55.88 24.77,55.88 26.67,53.98 A02.R2
BUS_ADDRESS_INVALID_L  (via drill 0.81)
  Top 0.508: A03.F1 34.93,33.02 33.02,34.93 33.02,37.47 33.66,38.1 33.66,40.64 33.02,41.28 33.02,43.82 33.66,44.45 v33.66,46.36 | v30.48,52.07 30.48,53.98 28.58,55.88 A02.T2
  Bottom 0.508: A01.T2 20.32,60.33 22.23,62.23 24.77,62.23 26.67,60.33 A02.T2 | v33.66,46.36 29.85,50.17 29.85,52.07 v30.48,52.07
BUS_CA_00_L  (via drill 0.81)
  Top 0.508: A02.K1 19.05,39.37 v16.51,39.37 15.24,39.37 10.8,43.82 10.8,44.45 14.61,48.26 14.61,52.07 10.8,55.88 10.8,58.42 17.78,65.41 17.78,66.67 17.15,67.31 17.15,85.09 v20.96,88.9
  Bottom 0.508: A01.K1 7.62,39.37 12.06,39.37 12.7,40.01 15.24,40.01 15.88,39.37 v16.51,39.37 | B03.F1 33.66,97.16 29.21,97.16 v20.96,88.9
BUS_CA_01_L  (via drill 0.81)
  Top 0.508: B03.H1 31.75,97.16 33.66,95.25 33.66,92.71 33.02,92.08 33.02,89.53 33.66,88.9 33.66,86.36 33.02,85.73 33.02,83.19 34.93,81.28 v34.93,74.3 | v12.06,72.39 11.43,71.76 11.43,64.14 7.62,60.33 7.62,57.79 11.43,53.98 11.43,51.44 7.62,47.62 7.62,45.09 11.43,41.28 11.43,38.73 10.8,38.1 10.8,35.56 22.23,24.13 A02.D1
  Bottom 0.508: A01.D1 10.8,23.5 15.24,23.5 15.88,24.13 18.42,24.13 20.32,22.22 A02.D1 | v34.93,74.3 33.02,72.39 v12.06,72.39
BUS_CA_02_L  (via drill 0.81)
  Top 0.508: v15.24,87.63 v27.3,99.7 | v4.45,79.38 4.45,44.45 7.62,41.28 A01.L1
  Bottom 0.508: A01.L1 10.8,42.55 15.24,42.55 15.88,43.18 17.78,43.18 19.69,41.28 A02.L1 | B03.J1 33.66,103.51 31.75,103.51 27.94,99.7 v27.3,99.7 | v15.24,87.63 14.61,87 12.7,87 5.08,79.38 v4.45,79.38
BUS_CA_03_L  (via drill 0.81)
  Top 0.508: B03.K1 33.02,109.22 33.02,113.67 33.66,114.3 33.66,116.84 33.02,117.48 33.02,120.02 33.66,120.65 33.66,121.28 v13.97,140.97
  Bottom 0.508: A02.C1 15.88,19.05 13.97,17.14 12.7,17.14 12.06,17.78 7.62,17.78 A01.C1 0.64,19.05 0.64,129.54 9.53,138.43 11.43,138.43 v13.97,140.97
BUS_CA_04_L  (via drill 0.81)
  Top 0.508: v27.94,109.22 27.3,108.59 27.3,105.41 v15.88,93.98 | v7.62,85.73 13.34,80.01 v13.34,71.12 | v22.23,68.58 24.13,66.67 24.13,64.14 23.5,63.5 23.5,60.96 24.13,60.33 24.13,57.79 20.32,53.98 20.32,51.44 24.13,47.62 24.13,45.09 23.5,44.45 23.5,41.91 24.13,41.28 24.13,38.73 20.32,34.93 20.32,32.39 22.23,30.48 A02.F1
  Bottom 0.508: A01.F1 10.8,29.85 15.24,29.85 15.88,30.48 18.42,30.48 20.32,28.57 A02.F1 | B03.L1 33.66,109.86 29.21,109.86 28.58,109.22 v27.94,109.22 | v7.62,85.73 v15.88,93.98 | v13.34,71.12 15.88,68.58 v22.23,68.58
BUS_CA_05_L  (via drill 0.81)
  Top 0.508: B03.M1 30.48,115.57 30.48,120.02 v29.85,120.65 | v73.66,123.19 73.66,83.82 72.39,82.55 v72.39,79.38 | v45.09,75.56 43.18,73.66 43.18,64.14 42.55,63.5 42.55,60.96 43.18,60.33 43.18,57.79 39.37,53.98 39.37,51.44 40.01,50.8 38.1,48.9 38.1,46.36 36.2,44.45 36.2,41.91 36.83,41.28 34.93,39.37 34.93,36.83 36.83,34.93 36.83,32.39 36.2,31.75 36.2,29.21 36.83,28.57 31.75,23.5 26.67,28.57 26.67,31.11 27.3,31.75 24.13,34.93 A02.J1
  Bottom 0.508: A01.J1 10.8,36.2 15.24,36.2 15.88,36.83 16.51,36.83 18.42,34.93 A02.J1 | v29.85,120.65 38.1,128.91 40.64,128.91 44.45,125.1 46.99,125.1 50.8,128.91 53.34,128.91 59.06,123.19 v73.66,123.19 | v72.39,79.38 72.39,75.56 v45.09,75.56
BUS_CA_06_L  (via drill 0.81)
  Top 0.508: B03.N1 35.56,118.11 35.56,122.56 36.83,123.83 36.83,125.73 v32.39,130.17 | v4.45,86.36 8.26,82.55 8.26,67.31 7.62,66.67 v7.62,64.77 | v4.45,33.02 4.45,27.3 A01.E1
  Bottom 0.508: A01.E1 7.62,26.67 12.06,26.67 12.7,27.3 15.24,27.3 17.15,25.4 A02.E1 | v32.39,130.17 24.13,138.43 15.88,138.43 4.45,127 v4.45,86.36 | v7.62,64.77 8.89,63.5 8.89,61.59 4.45,57.15 v4.45,33.02
BUS_CA_07_L  (via drill 0.81)
  Top 0.508: v16.51,33.02 19.05,33.02 A02.H1 | v26.67,119.38 20.32,113.03 20.32,109.86 24.13,106.05 24.13,104.14 v13.97,93.98 | v4.45,84.45 4.45,81.28 5.72,80.01 v5.72,65.41
  Bottom 0.508: v16.51,33.02 15.88,33.02 15.24,33.66 12.7,33.66 12.06,33.02 7.62,33.02 A01.H1 3.17,31.75 3.17,62.87 v5.72,65.41 | B03.P1 30.48,119.38 v26.67,119.38 | v4.45,84.45 v13.97,93.98
BUS_DATA&CLOCK_L
  Bottom 0.508: A01.F2 17.15,27.3 21.59,27.3 22.23,26.67 24.77,26.67 26.67,28.57 A02.F2 30.48,28.57 32.39,30.48 34.93,30.48 38.73,26.67 41.28,26.67 45.09,30.48 47.62,30.48 48.26,29.85 52.7,29.85 A04.F2
BUS_FILE_READY
  Bottom 0.508: B01.N1 10.8,118.75 15.24,118.75 15.88,119.38 18.42,119.38 20.32,117.48 B02.N1
BUS_INDEX_L  (via drill 0.81)
  Top 0.508: v14.61,116.2 16.51,114.3 B02.M1
  Bottom 0.508: B01.M1 7.62,115.57 12.06,115.57 12.7,116.2 v14.61,116.2 | B04.M1 43.18,115.57 38.73,115.57 34.93,119.38 32.39,119.38 25.4,112.39 22.86,112.39 20.96,114.3 B02.M1
BUS_READ_GATE_L
  Bottom 0.508: B01.R1 13.97,123.83 15.88,125.73 18.42,125.73 20.32,123.83 B02.R1
BUS_RESTORE_L  (via drill 0.81)
  Top 0.508: A02.M1 19.05,46.36 v15.88,49.53 17.78,51.44 17.78,53.98 13.97,57.79 13.97,60.33 19.05,65.41 19.05,71.76 v20.96,73.66 | B03.E1 27.3,95.25 27.3,92.71 23.5,88.9 23.5,86.36 24.13,85.73 24.13,83.19 23.5,82.55 v23.5,76.2
  Bottom 0.508: A01.M1 7.62,45.72 12.06,45.72 v15.88,49.53 | v20.96,73.66 v23.5,76.2
BUS_RWS_READY_L
  Top 0.508: A03.C1 30.48,20.32 30.48,23.5 25.4,28.57 A02.H2
  Bottom 0.508: A01.H2 17.15,31.75 19.05,33.66 21.59,33.66 23.5,31.75 A02.H2
BUS_SECTOR_ADDR_0L
  Bottom 0.508: B01.L1 10.8,112.39 15.24,112.39 15.88,113.03 18.42,113.03 20.32,111.12 B02.L1 25.4,111.12 30.48,116.2 31.75,116.2 35.56,112.39 38.1,112.39 38.73,113.03 41.28,113.03 43.18,111.12 B04.L1
BUS_SECTOR_ADDR_1L
  Bottom 0.508: A01.P2 13.97,52.07 18.42,52.07 19.05,52.71 21.59,52.71 23.5,50.8 A02.P2 27.3,50.8 35.56,59.05 38.1,59.05 45.09,52.07 49.53,52.07 A04.P2
BUS_SECTOR_ADDR_2L
  Bottom 0.508: B01.K2 17.15,107.95 19.05,106.05 21.59,106.05 23.5,107.95 B02.K2 27.3,107.95 29.21,106.05 31.75,106.05 35.56,109.86 38.1,109.86 38.73,109.22 41.28,109.22 41.91,109.86 44.45,109.86 45.09,109.22 49.53,109.22 B04.K2
BUS_SECTOR_ADDR_3L
  Bottom 0.508: B01.J1 10.8,106.05 15.24,106.05 15.88,106.68 17.15,106.68 19.05,104.78 B02.J1 24.13,104.78 26.04,102.87 29.85,102.87 33.66,106.68 34.93,106.68 35.56,106.05 38.1,106.05 38.73,106.68 41.28,106.68 41.91,106.05 46.36,106.05 B04.J1
BUS_SECTOR_PULSE_L
  Top 0.508: B01.N2 20.32,117.48 25.4,122.56 27.94,122.56 27.94,118.11 B02.N2
BUS_SEEK_INCOMPLETE_L
  Top 0.508: A03.H1 30.48,33.02 30.48,34.93 26.67,38.73 26.67,43.82 27.3,44.45 27.3,46.99 23.5,50.8 23.5,53.34 25.4,55.25 A02.S2
  Bottom 0.508: A01.S2 13.97,58.42 18.42,58.42 19.05,59.05 21.59,59.05 23.5,57.15 A02.S2
BUS_STROBE_L  (via drill 0.81)
  Top 0.508: B01.H1 4.45,103.51 4.45,107.95 12.7,116.2 13.34,116.2 13.34,115.57 20.96,107.95 20.96,105.41 19.05,103.51 B02.H1 | B03.D1 34.93,96.52 v33.02,98.42 | v27.3,101.6 v30.48,98.42
  Bottom 0.508: v30.48,98.42 v33.02,98.42 | v27.3,101.6 25.4,99.7 22.86,99.7 20.96,101.6 B02.H1
BUS_WP_SET_L
  Top 0.508: B01.R2 20.32,123.83 22.23,125.73 24.77,125.73 26.67,123.83 B02.R2
BUS_WP_STATUS_L  (via drill 0.81)
  Top 0.508: v14.61,122.56 16.51,120.65 B02.P1
  Bottom 0.508: B01.P1 7.62,121.92 12.06,121.92 12.7,122.56 v14.61,122.56
BUS_WRITE_GATE_L  (via drill 0.81)
  Top 0.508: v49.53,112.39 42.55,119.38 38.73,119.38 38.73,116.84 36.2,114.3 36.2,111.76 36.83,111.12 36.83,109.86 31.75,104.78 30.48,104.78 30.48,106.05 28.58,107.95 29.21,108.59 29.21,110.49 B02.L2
  Bottom 0.508: B01.L2 16.51,110.49 19.69,110.49 20.96,109.22 24.77,109.22 26.67,111.12 B02.L2 | B04.L2 52.7,112.39 v49.53,112.39
CA_SW_1  (via drill 0.81)  (1 unrouted)
  Top 0.508: SV1.22 66.67,105.41 v66.67,100.33 | v31.75,93.34 29.85,91.44 29.85,86.36 30.48,85.73 30.48,83.19 29.21,81.92 v29.21,69.85 | v215.9,107.95 229.87,121.92 231.77,121.92 CYL1.3
  Bottom 0.508: v66.67,100.33 51.44,100.33 50.8,99.7 48.26,99.7 44.45,103.51 41.91,103.51 v31.75,93.34 | v29.21,69.85 32.39,66.67 A03.V1 | SV2.22 85.73,107.95 v215.9,107.95
CA_SW_2  (via drill 0.81)  (1 unrouted)
  Top 0.508: v59.69,105.41 58.42,104.14 v58.42,78.11 | v33.66,78.11 31.75,76.2 A03.U1 | SV2.24 85.73,105.41 v85.73,110.49
  Bottom 0.508: SV1.24 66.67,105.41 v59.69,105.41 | v33.66,78.11 v58.42,78.11 | v85.73,110.49 95.89,110.49 99.7,114.3 203.2,114.3 210.82,121.92 212.73,121.92 CYL2.3
CA_SW_4  (via drill 0.81)  (1 unrouted)
  Top 0.508: v73.66,75.56 v73.66,81.92 | v54.61,74.3 53.34,73.03 v53.34,71.76 | v36.83,72.39 36.83,66.04 31.75,60.96 A03.S1 | SV2.26 83.19,102.87 v83.19,115.57
  Bottom 0.508: SV1.26 73.66,95.89 v73.66,81.92 | v73.66,75.56 72.39,74.3 v54.61,74.3 | v53.34,71.76 45.72,71.76 45.09,72.39 v36.83,72.39 | v83.19,115.57 83.19,118.11 91.44,118.11 93.98,115.57 185.42,115.57 191.77,121.92 193.68,121.92 CYL4.3
CA_SW_8  (via drill 0.81)  (1 unrouted)
  Top 0.508: SV1.28 69.22,97.79 v69.22,79.38 | v38.73,79.38 38.1,78.74 38.1,65.41 36.2,63.5 36.2,60.96 36.83,60.33 36.83,57.79 34.93,55.88 A03.R1 | SV2.28 83.19,97.79 83.19,85.73 83.82,85.09 93.34,85.09 93.34,81.28 93.98,80.64 169.55,80.64 169.55,118.75 172.72,121.92 174.62,121.92 CYL8.3
  Bottom 0.508: v38.73,79.38 v69.22,79.38
CA_SW_16  (via drill 0.81)  (1 unrouted)
  Top 0.508: v43.18,91.44 42.55,90.81 42.55,86.36 43.18,85.73 43.18,83.19 42.55,82.55 v42.55,76.84 | v30.48,75.56 30.48,64.14 29.85,63.5 29.85,60.96 30.48,60.33 30.48,57.79 29.85,57.15 29.85,55.88 31.75,53.98 A03.P1 | v137.8,94.62 150.5,107.31 150.5,118.75 153.67,121.92 155.57,121.92 CYL16.3
  Bottom 0.508: SV1.30 66.67,95.25 52.7,95.25 50.8,93.34 48.26,93.34 47.62,93.98 45.72,93.98 v43.18,91.44 | v42.55,76.84 41.28,75.56 v30.48,75.56 | SV2.30 81.92,93.98 81.92,87.63 87.63,87.63 93.34,81.92 93.34,80.64 121.92,80.64 135.89,94.62 v137.8,94.62
CA_SW_32  (via drill 0.81)  (1 unrouted)
  Top 0.508: v59.69,48.26 v59.69,92.71 | v129.54,100.97 129.54,117.48 133.99,121.92 136.53,121.92 CYL32.3
  Bottom 0.508: SV1.32 66.67,92.71 v59.69,92.71 | v59.69,48.26 57.15,45.72 51.44,45.72 50.8,46.36 48.26,46.36 44.45,42.55 43.82,42.55 38.73,47.62 A03.N1 | SV2.32 83.19,92.71 83.19,90.17 118.75,90.17 v129.54,100.97
CA_SW_64  (via drill 0.81)  (1 unrouted)
  Top 0.508: v50.8,90.81 48.9,88.9 48.9,86.36 49.53,85.73 49.53,84.45 47.62,82.55 v47.62,68.58 | v33.02,60.33 33.66,59.69 33.66,54.61 33.02,53.98 33.02,51.44 33.66,50.8 33.66,48.26 31.75,46.36 A03.M1 | v112.4,100.33 112.4,118.75 115.57,121.92 117.47,121.92 CYL64.3
  Bottom 0.508: SV1.34 66.67,90.17 51.44,90.17 v50.8,90.81 | v47.62,68.58 41.28,68.58 v33.02,60.33 | SV2.34 85.73,92.71 95.89,92.71 97.79,94.62 99.7,94.62 105.41,100.33 v112.4,100.33
CA_SW_128  (via drill 0.81)  (1 unrouted)
  Top 0.508: v43.18,98.42 39.37,94.62 39.37,89.53 40.01,88.9 40.01,86.36 39.37,85.73 39.37,83.19 40.01,82.55 40.01,67.31 39.37,66.67 39.37,64.14 40.01,63.5 40.01,60.96 39.37,60.33 39.37,57.79 40.01,57.15 40.01,55.88 36.2,52.07 36.2,48.26 36.83,47.62 36.83,46.36 34.93,44.45 A03.L1 | SV2.36 85.73,90.17 93.34,90.17 93.34,118.75 96.52,121.92 98.43,121.92 CYL128.3
  Bottom 0.508: SV1.36 69.22,90.17 69.22,97.79 58.42,97.79 57.15,96.52 51.44,96.52 50.8,97.16 48.26,97.16 47.62,96.52 45.09,96.52 v43.18,98.42
CONSTANT_WRITE_L  (via drill 0.81)  (1 unrouted)
  Top 0.508: SV3.38 69.22,17.78 v69.22,69.85 | v46.36,73.03 46.36,85.09 45.72,85.73 45.72,88.27 46.36,88.9 46.36,91.44 44.45,93.34 B04.E1 | SV4.38 85.73,15.24 258.44,15.24 258.44,121.92 CONSTANT_WRITE.2
  Bottom 0.508: v69.22,69.85 66.04,73.03 v46.36,73.03
DATA_BITS  (via drill 0.81)  (1 unrouted)
  Top 0.508: v62.87,106.68 63.5,106.05 v63.5,93.98 | 320.68,122.56 301.62,122.56 BIT0.3 | 320.68,122.56 339.72,122.56 | 320.68,122.56 BIT1.3 | 339.72,122.56 358.77,122.56 BIT3.3 | 339.72,122.56 BIT2.3
  Bottom 0.508: v62.87,106.68 SV1.19 | v63.5,93.98 52.7,93.98 50.8,92.08 49.53,92.08 46.36,88.9 B04.C1 | SV2.19 95.89,109.22 99.7,113.03 290.83,113.03 299.72,121.92 301.62,121.92 BIT0.3
DC_ERASE  (via drill 0.81)  (1 unrouted)
  Top 0.508: v57.15,20.32 57.15,44.45 55.88,45.72 55.88,52.71 57.15,53.98 57.15,73.66 52.7,78.11 52.7,85.09 52.07,85.73 52.07,88.27 52.7,88.9 52.7,91.44 48.9,95.25 48.9,97.79 57.15,106.05 v57.15,120.65 | SV4.34 85.73,22.86 214.63,22.86 214.63,43.18 230.5,59.05 230.5,81.28 255.91,106.68 v255.91,117.48
  Bottom 0.508: SV3.34 66.67,20.32 v57.15,20.32 | B04.P2 v57.15,120.65 | v255.91,117.48 263.52,125.1 280.67,125.1 DC_ERASE.2
FWD_L  (via drill 0.81)  (1 unrouted)
  Top 0.508: SV1.8 66.67,123.19 66.67,111.12 66.04,110.49 60.96,110.49 v60.96,26.67 | v93.98,125.73 97.16,128.91 128.27,128.91 128.27,95.89 136.53,87.63 FWD/REV.3
  Bottom 0.508: v60.96,26.67 58.42,24.13 51.44,24.13 50.8,23.5 48.26,23.5 47.62,24.13 45.09,24.13 44.45,23.5 41.91,23.5 41.28,24.13 38.73,24.13 36.83,22.22 A03.D1 | SV2.8 85.73,125.73 v93.98,125.73
GND  (via drill 0.81)  (3 unrouted)
  Top 0.813: 20.96,61.59 22.23,61.59 A02.T1 | 20.96,61.59 v19.69,61.59 | SV3.7 SV3.9 SV3.11 SV3.13 SV3.15 SV3.17 SV3.19 SV3.21 SV3.23 SV3.25 62.23,31.75 | SV3.39 SV3.37 SV3.35 65.41,20.95 | SV3.31 SV3.33 65.41,20.95 | 62.23,31.75 62.23,24.13 65.41,20.95 | 62.23,31.75 v62.23,58.42 | SV1.39 SV1.37 SV1.35 SV1.33 SV1.31 SV1.29 SV1.27 SV1.25 SV1.23 SV1.21 63.5,108.59 v63.5,109.22 | B01.T1 13.97,130.17 13.97,130.81 15.24,132.08 17.78,132.08 19.69,130.17 B02.T1 | SV1.17 SV1.15 SV1.13 63.5,118.75 63.5,122.56 SV1.7 SV1.5 SV1.3 SV1.1 | 20.96,61.59 20.96,65.41 20.32,66.04 20.32,71.12 22.23,73.03 22.23,83.19 20.32,85.09 v20.32,86.36
  Bottom 0.813: A01.T1 10.8,61.59 14.61,61.59 15.24,62.23 17.78,62.23 18.42,61.59 v19.69,61.59 | A02.T1 24.77,60.33 26.67,58.42 29.21,58.42 29.85,59.05 33.66,59.05 A03.T1 37.47,60.33 39.37,62.23 41.91,62.23 42.55,61.59 46.36,61.59 A04.T1 51.44,60.33 53.34,58.42 v62.23,58.42 | A01.C2 13.97,20.32 17.78,20.32 18.42,20.95 20.96,20.95 22.86,19.05 A02.C2 27.94,19.05 29.85,20.95 32.39,20.95 33.02,20.32 36.83,20.32 A03.C2 39.37,20.32 43.18,20.32 43.82,20.95 46.36,20.95 48.26,19.05 A04.C2 SV3.35 | B01.C2 16.51,88.9 18.42,87 20.32,87 | 20.32,87 20.96,87 22.86,88.9 B02.C2 29.21,88.9 31.12,90.81 33.66,90.81 35.56,88.9 B03.C2 38.73,88.27 42.55,88.27 43.82,87 46.36,87 48.26,88.9 B04.C2 SV1.35 | B02.T1 24.77,130.17 26.67,128.27 29.21,128.27 29.85,128.91 33.66,128.91 B03.T1 36.2,131.44 40.01,131.44 40.64,132.08 43.18,132.08 45.09,130.17 B04.T1 48.9,131.44 52.7,131.44 53.34,132.08 SV1.1 | v63.5,109.22 63.5,111.76 SV1.17 | 20.32,87 v20.32,86.36 | CYL128.NC@1 96.84,136.52 CYL128.NC@2
  pour Top: 79.38,0 377.82,0 377.82,149.22 79.38,149.22
  pour Bottom: 79.38,0 377.82,0 377.82,149.22 79.38,149.22
  pour Bottom: 0,0 76.2,0 76.2,149.22 0,149.22
HEAD_SELECT_L  (via drill 0.81)  (1 unrouted)
  Top 0.508: v53.98,55.88 47.62,62.23 47.62,64.77 44.45,67.95 v44.45,71.12 | v15.88,71.12 14.61,72.39 14.61,85.09 13.97,85.73 13.97,88.27 14.61,88.9 14.61,91.44 7.62,98.42 7.62,100.97 11.43,104.78 11.43,107.31 10.8,107.95 10.8,110.49 12.7,112.39 B01.M2 | v102.87,73.03 SV4.5
  Bottom 0.508: SV3.5 64.14,55.88 v53.98,55.88 | v15.88,71.12 v44.45,71.12 | B02.M2 24.13,115.57 19.69,115.57 19.05,116.2 16.51,116.2 14.61,114.3 B01.M2 | v102.87,73.03 327.02,73.03 HEAD.2
N$21  (1 unrouted)
N$30
  Bottom 0.508: RUN.2 102.87,96.52 117.47,96.52 RTZ.1
N$37
  Top 0.508: ADDR_INV.A R1.1
N$38
  Top 0.508: SEEK_INC.A R2.1
N$39
  Top 0.508: POWER.A R3.1
N$45
  Bottom 0.508: A01.U2 13.97,64.77 18.42,64.77 19.05,65.41 21.59,65.41 23.5,63.5 A02.U2
N$49
  Bottom 0.508: B01.T2 17.15,131.44 21.59,131.44 22.23,132.08 24.77,132.08 26.67,130.17 B02.T2
N$50
  Bottom 0.508: A01.B1 13.97,15.88 15.88,17.78 18.42,17.78 20.32,15.88 A02.B1
N$51
  Bottom 0.508: B01.F1 10.8,99.7 15.24,99.7 15.88,100.33 18.42,100.33 20.32,98.42 B02.F1
N$52
  Bottom 0.508: B01.F2 17.15,97.16 21.59,97.16 22.23,96.52 24.77,96.52 26.67,98.42 B02.F2
N$54
  Bottom 0.508: B01.H2 13.97,102.87 18.42,102.87 19.05,103.51 21.59,103.51 23.5,101.6 B02.H2
N$56
  Bottom 0.508: B01.K1 7.62,109.22 12.06,109.22 12.7,109.86 15.24,109.86 15.88,109.22 17.78,109.22 B02.K1
N$74
  Bottom 0.508: B01.P2 13.34,121.28 17.78,121.28 19.05,122.56 21.59,122.56 23.5,120.65 B02.P2
N$79
  Bottom 0.508: B01.U2 13.97,134.62 18.42,134.62 19.05,135.25 21.59,135.25 23.5,133.35 B02.U2
OSC_L  (via drill 0.81)  (1 unrouted)
  Top 0.508: v66.67,22.86 66.67,13.34 67.95,12.07 74.93,12.07 v74.93,96.52 | v47.62,106.68 41.28,100.33 B03.F2 | SV4.29 100.33,26.67 100.33,26.04 100.97,25.4 106.68,25.4 106.68,34.93 FUNCTION.A3
  Bottom 0.508: SV3.29 66.67,25.4 v66.67,22.86 | v74.93,96.52 68.58,102.87 51.44,102.87 v47.62,106.68
RANDOM_L  (via drill 0.81)  (1 unrouted)
  Top 0.508: v55.88,27.94 55.88,19.68 47.62,11.43 47.62,10.16 45.72,8.25 42.55,8.25 40.01,10.8 40.01,15.24 33.02,22.22 33.02,23.5 40.01,30.48 40.01,34.29 36.2,38.1 36.2,39.37 40.01,43.18 40.01,46.99 39.37,47.62 39.37,48.9 41.28,50.8 A03.R2 | FUNCTION.A4 106.68,40.64 103.5,36.83 D1.C 101.6,27.94 85.73,27.94 SV4.30
  Bottom 0.508: SV3.30 66.67,27.94 v55.88,27.94
READ_CLOCK
  Bottom 0.508: B01.S1 7.62,125.73 12.06,125.73 12.7,125.1 13.97,125.1 15.88,127 B02.S1
READ_DATA
  Bottom 0.508: B01.S2 13.97,128.27 18.42,128.27 19.05,128.91 21.59,128.91 23.5,127 B02.S2
REV_L  (via drill 0.81)  (1 unrouted)
  Top 0.508: SV1.6 66.67,128.27 66.67,132.71 60.96,138.43 52.07,138.43 52.07,133.98 55.88,130.17 55.88,109.22 v40.64,93.98 | v28.58,90.17 26.67,88.27 26.67,83.19 27.3,82.55 27.3,67.31 26.67,66.67 26.67,64.14 27.3,63.5 27.3,60.96 26.67,60.33 26.67,57.79 27.3,57.15 27.3,54.61 26.67,53.98 26.67,51.44 30.48,47.62 30.48,45.09 29.85,44.45 29.85,41.91 30.48,41.28 30.48,38.73 29.85,38.1 29.85,36.83 33.66,33.02 33.66,29.21 31.75,27.3 A03.E1 | v130.81,116.84 131.44,116.2 131.44,100.33 134.62,97.16 136.53,97.16 FWD/REV.1
  Bottom 0.508: v40.64,93.98 40.01,93.34 35.56,93.34 34.93,93.98 34.29,93.98 32.39,92.08 30.48,92.08 v28.58,90.17 | SV2.6 85.73,128.27 96.52,128.27 97.16,128.91 118.75,128.91 v130.81,116.84
RTZ_L  (via drill 0.81)  (1 unrouted)
  Top 0.508: SV1.10 69.85,120.02 69.85,98.42 71.12,97.16 v71.12,82.55 | v40.01,6.99 34.93,12.07 A03.B1 | v99.7,124.46 111.12,113.03 111.12,93.98 117.47,87.63 RTZ.3
  Bottom 0.508: v71.12,82.55 74.93,78.74 74.93,6.99 v40.01,6.99 | SV2.10 85.73,123.19 96.52,123.19 97.79,124.46 v99.7,124.46
RUN_L  (via drill 0.81)  (1 unrouted)
  Top 0.508: v62.23,118.11 58.42,114.3 58.42,105.41 55.88,102.87 55.88,76.2 58.42,73.66 58.42,45.72 59.69,44.45 59.69,16.51 47.62,4.45 31.75,4.45 A03.A1 | SV2.12 85.73,118.11 88.27,118.11 v88.27,100.33
  Bottom 0.508: SV1.12 66.67,118.11 v62.23,118.11 | v88.27,100.33 91.44,97.16 98.43,97.16 RUN.1
SECTOR_0L  (via drill 0.81)  (1 unrouted)
  Top 0.508: v55.88,40.64 55.25,40.01 55.25,38.73 48.26,31.75 A04.H1
  Bottom 0.508: SV3.20 66.67,40.64 v55.88,40.64 | SV4.20 81.92,36.83 81.92,20.32 302.89,20.32 SECTOR.2
SECTOR_1L  (1 unrouted)
  Bottom 0.508: SV3.18 69.22,40.64 69.22,33.02 52.7,33.02 50.8,34.93 A04.J1 | SV4.18 85.73,40.64 104.14,40.64 107.31,43.82 301.62,43.82 309.88,35.56 SECTOR.3
SECTOR_2L  (via drill 0.81)  (1 unrouted)
  Top 0.508: v48.26,38.1 v53.34,43.18
  Bottom 0.508: SV3.16 66.67,43.18 v53.34,43.18 | A04.K1 v48.26,38.1 | SV4.16 85.73,43.18 104.78,43.18 112.4,50.8 300.36,50.8 309.88,41.28 SECTOR.4
SECTOR_3L  (1 unrouted)
  Bottom 0.508: SV3.14 66.67,45.72 58.42,45.72 57.15,44.45 52.7,44.45 49.53,41.28 A04.L1 | SV4.14 85.73,45.72 101.6,45.72 109.86,53.98 304.8,53.98 SECTOR.5
SECTOR_4L  (1 unrouted)
  Bottom 0.508: SV3.12 66.67,50.8 52.7,50.8 49.53,47.62 A04.N1 | SV4.12 85.73,48.26 98.43,48.26 106.68,56.52 309.88,56.52 317.5,48.9 SECTOR.6
SECTOR_5L  (via drill 0.81)  (1 unrouted)
  Top 0.508: v53.98,49.53 50.8,52.71 48.26,52.71 46.36,50.8 A04.P1
  Bottom 0.508: SV3.10 69.22,50.8 69.22,48.26 61.59,48.26 60.33,49.53 v53.98,49.53 | SV4.10 85.73,50.8 90.17,50.8 91.44,52.07 98.43,52.07 104.14,57.79 314.32,57.79 323.21,48.9 SECTOR.7
SECTOR_6L  (via drill 0.81)  (1 unrouted)
  Top 0.508: v45.72,64.77 46.36,64.14 46.36,60.96 45.72,60.33 45.72,57.79 47.62,55.88 A04.R1
  Bottom 0.508: SV3.8 69.22,55.88 69.22,63.5 52.7,63.5 50.8,65.41 48.26,65.41 47.62,64.77 v45.72,64.77 | SV4.8 85.73,53.34 98.43,53.34 104.14,59.05 315.6,59.05 328.3,46.36 SECTOR.8
SECTOR_7L  (via drill 0.81)  (1 unrouted)
  Top 0.508: v313.69,62.87 330.83,45.72 330.83,41.28 SECTOR.9
  Bottom 0.508: SV3.6 66.67,58.42 64.14,58.42 62.87,57.15 52.7,57.15 50.8,59.05 48.26,59.05 46.36,57.15 A04.S1 | SV4.6 85.73,58.42 88.27,58.42 92.71,62.87 v313.69,62.87
SECTOR_8L  (1 unrouted)
  Top 0.508: SV4.4 81.92,57.15 81.92,14.61 83.82,12.7 330.83,12.7 330.83,34.93 SECTOR.10
  Bottom 0.508: SV3.4 66.67,60.96 55.25,60.96 53.98,62.23 51.44,62.23 50.8,61.59 48.26,61.59 46.36,63.5 A04.U1
SECTOR_9L  (via drill 0.81)  (1 unrouted)
  Top 0.508: v67.95,64.77 SV3.2 | v295.91,65.41 328.3,33.02 328.3,30.48 SECTOR.11
  Bottom 0.508: v67.95,64.77 52.7,64.77 50.8,66.67 A04.V1 | SV4.2 87.63,65.41 v295.91,65.41
SECTOR_SELECT_L  (via drill 0.81)  (1 unrouted)
  Top 0.508: v58.42,29.21 58.42,44.45 57.15,45.72 v57.15,52.07 | v55.88,54.61 55.25,55.25 55.25,57.15 48.9,63.5 48.9,66.04 49.53,66.67 v49.53,74.3 | v36.83,74.3 36.2,74.93 36.2,85.09 36.83,85.73 36.83,88.27 36.2,88.9 v36.2,90.17
  Bottom 0.508: v58.42,29.21 SV3.27 | v57.15,52.07 57.15,54.61 v55.88,54.61 | v36.83,74.3 v49.53,74.3 | v36.2,90.17 36.83,90.81 40.64,90.81 41.28,90.17 43.82,90.17 45.72,92.08 B04.D1 | SV4.27 85.73,27.94 83.82,27.94 83.19,27.3 83.19,22.86 302.89,22.86 314.96,34.93 317.5,34.93 SECTOR.A
SEEK_INCOMPLETE_L  (via drill 0.81)  (1 unrouted)
  Top 0.508: v54.61,121.92 52.07,119.38 52.07,114.94 52.7,114.3 52.7,113.67 38.1,99.06 B03.E2
  Bottom 0.508: v54.61,121.92 SV1.9 | SV2.9 85.73,120.65 83.82,120.65 81.92,118.75 81.92,102.87 88.27,102.87 89.53,104.14 165.1,104.14 SEEK_INC.B
SELECT_0L  (via drill 0.81)  (1 unrouted)
  Top 0.508: A01.J2 19.05,34.93 v19.05,36.2
  Bottom 0.508: SV3.28 66.67,30.48 53.98,30.48 50.8,33.66 48.26,33.66 47.62,33.02 45.09,33.02 41.28,36.83 38.73,36.83 34.93,33.02 32.39,33.02 30.48,34.93 A02.J2 26.67,34.93 24.77,36.83 19.69,36.83 v19.05,36.2 | SV4.28 83.19,30.48 83.19,33.02 126.37,33.02 131.44,27.94 225.43,27.94 DRIVE.A1
SELECT_1L  (via drill 0.81)  (1 unrouted)
  Top 0.508: SV3.26 66.67,30.48 63.5,30.48 v63.5,26.67 | v58.42,22.86 58.42,16.51 47.62,5.72 33.66,5.72 33.66,13.97 12.7,34.93 A01.K2
  Bottom 0.508: v63.5,26.67 59.69,22.86 v58.42,22.86 | A02.K2 24.13,39.37 19.69,39.37 19.05,40.01 17.15,38.1 A01.K2 | SV4.26 85.73,30.48 107.31,30.48 109.22,28.57 110.49,28.57 112.4,30.48 122.56,30.48 127.64,25.4 226.06,25.4 227.33,26.67 227.33,29.85 220.98,29.85 DRIVE.A2
SELECT_2L  (via drill 0.81)  (1 unrouted)
  Top 0.508: A01.L2 20.32,41.28 v20.32,42.55
  Bottom 0.508: SV3.24 66.67,35.56 55.25,35.56 50.8,40.01 48.26,40.01 47.62,39.37 45.09,39.37 44.45,40.01 41.91,40.01 41.28,39.37 38.73,39.37 38.1,40.01 35.56,40.01 34.93,39.37 32.39,39.37 30.48,41.28 A02.L2 26.67,41.28 24.77,43.18 20.96,43.18 v20.32,42.55 | SV4.24 85.73,35.56 104.78,35.56 106.05,36.83 216.54,36.83 217.81,35.56 DRIVE.A3
SELECT_3L  (via drill 0.81)  (1 unrouted)
  Top 0.508: v53.98,39.37 50.8,36.2 48.26,36.2 v41.28,43.18
  Bottom 0.508: SV3.22 66.67,38.1 55.25,38.1 v53.98,39.37 | v41.28,43.18 40.64,42.55 35.56,42.55 31.75,46.36 29.21,46.36 27.3,44.45 A02.M2 23.5,44.45 21.59,46.36 19.05,46.36 18.42,45.72 13.97,45.72 A01.M2 | SV4.22 85.73,38.1 215.26,38.1 217.81,40.64 DRIVE.A4
STEP_L  (via drill 0.81)  (1 unrouted)
  Top 0.508: SV3.32 66.67,25.4 63.5,25.4 v63.5,24.77 | v42.55,31.75 v53.98,20.32
  Bottom 0.508: v63.5,24.77 60.33,21.59 55.25,21.59 v53.98,20.32 | A03.H2 v42.55,31.75 | FUNCTION.A1 114.3,27.3 112.4,25.4 104.78,25.4 103.5,26.67 D1.A 100.33,25.4 85.73,25.4 SV4.32
VCC  (via drill 0.81)  (1 unrouted)
  Top 0.813: A01.A2 11.43,13.97 11.43,17.78 3.17,26.04 v3.17,29.85
  Bottom 0.813: A01.A2 14.61,10.8 23.5,10.8 | A02.A2 23.5,10.8 | 23.5,10.8 36.2,10.8 A03.A2 40.64,12.7 42.55,14.61 45.09,14.61 45.72,13.97 49.53,13.97 A04.A2 | SV1.38 69.85,84.45 69.85,80.64 52.7,80.64 51.44,81.92 | B04.A2 51.44,81.92 | 23.5,80.64 14.61,80.64 B01.A2 6.98,76.84 1.91,76.84 1.91,31.11 v3.17,29.85 | B02.A2 23.5,80.64 | 36.2,80.64 B03.A2 | 23.5,80.64 36.2,80.64 | 51.44,81.92 50.17,80.64 36.2,80.64 | SV2.38 82.55,84.45 82.55,79.38 254.63,79.38 POWER1.2
WRITE_H  (via drill 0.81)  (1 unrouted)
  Top 0.508: v55.88,59.69 55.88,67.31 50.8,72.39 50.8,80.01 v48.9,81.92
  Bottom 0.508: v55.88,59.69 SV3.3 | v48.9,81.92 48.26,82.55 B04.A1 | SV4.3 91.44,64.14 320.04,64.14 339.72,83.82 352.43,83.82 358.77,90.17 WRITE_BUTTON.1
WRITE_L  (via drill 0.81)  (1 unrouted)
  Top 0.508: SV3.1 62.23,65.41 v62.23,81.92
  Bottom 0.508: v62.23,81.92 56.52,87.63 51.44,87.63 49.53,85.73 B04.B1 | SV4.1 85.73,60.96 83.82,60.96 83.19,60.33 83.19,55.88 88.27,55.88 93.98,61.59 337.82,61.59 356.87,80.64 358.77,80.64 WRITE_BUTTON.3